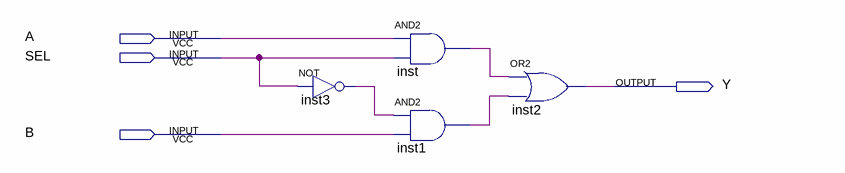
[diagram p0: schematic sheet]
// Quartus schematic Selector.bdf as structural Verilog: 4 symbols, 4 pins
module Selector (
  input  A,
  input  SEL,
  input  B,
  output Y
);

  wire inst1_out, inst3_out, inst_out;

  not inst3 (inst3_out, SEL);
  and inst (inst_out, A, SEL);
  and inst1 (inst1_out, inst3_out, B);
  or inst2 (Y, inst_out, inst1_out);
endmodule
